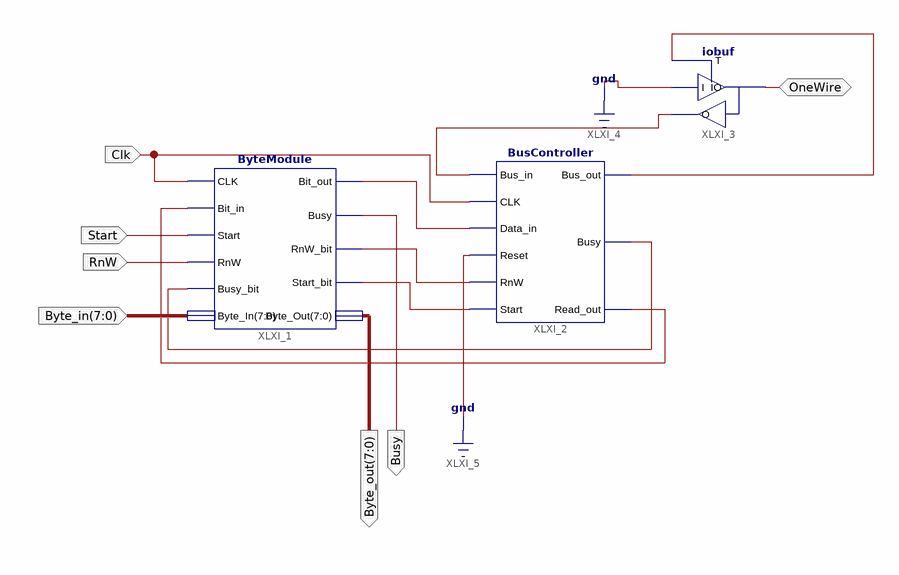
[diagram p0: schematic sheet 1]
// Xilinx ISE schematic Bus_byte_test.sch (spartan3e) as structural Verilog: 3 symbols, 7 ports
module Bus_byte_test (
  input  Clk,
  input  Start,
  input  RnW,
  input  [7:0] Byte_in,
  inout  OneWire,
  output [7:0] Byte_out,
  output Busy
);

  wire XLXN_9, XLXN_10, XLXN_11, XLXN_12, XLXN_13, XLXN_27, XLXN_28;

  ByteModule XLXI_1 (
    .CLK(Clk), .Bit_in(XLXN_12), .Start(Start), .RnW(RnW), .Busy_bit(XLXN_13), .Byte_In(Byte_in),
    .Bit_out(XLXN_9), .Busy(Busy), .RnW_bit(XLXN_10), .Start_bit(XLXN_11), .Byte_Out(Byte_out));
  BusController XLXI_2 (
    .Bus_in(XLXN_28), .CLK(Clk), .Data_in(XLXN_9), .Reset(1'b0), .RnW(XLXN_10), .Start(XLXN_11),
    .Bus_out(XLXN_27), .Busy(XLXN_13), .Read_out(XLXN_12));
  iobuf XLXI_3 (.I(1'b0), .IO(OneWire), .O(XLXN_28), .T(XLXN_27));
endmodule
